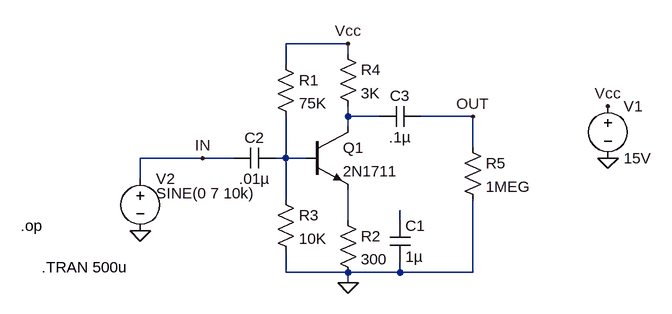
[diagram p0: schematic AMP.asc]
AMP.asc, the LTspice schematic file:
Version 4
SHEET 1 880 680
WIRE 32 32 -64 32
WIRE 32 48 32 32
WIRE -64 64 -64 32
WIRE 32 144 32 128
WIRE 80 144 32 144
WIRE 224 144 144 144
WIRE 32 160 32 144
WIRE 224 192 224 144
WIRE -192 208 -288 208
WIRE -144 208 -192 208
WIRE -64 208 -64 144
WIRE -64 208 -80 208
WIRE -32 208 -64 208
WIRE -288 240 -288 208
WIRE -64 272 -64 208
WIRE 32 304 32 256
WIRE 112 304 112 288
WIRE -64 384 -64 352
WIRE 32 384 -64 384
WIRE 112 384 112 368
WIRE 112 384 32 384
WIRE 224 384 224 272
WIRE 224 384 112 384
WIRE 32 400 32 384
FLAG 32 400 0
FLAG 432 208 0
FLAG 432 128 Vcc
FLAG 32 32 Vcc
FLAG -288 320 0
FLAG 224 144 OUT
FLAG -192 208 IN
SYMBOL npn -32 160 R0
SYMATTR InstName Q1
SYMATTR Value 2N1711
SYMBOL res -80 48 R0
SYMATTR InstName R1
SYMATTR Value 75K
SYMBOL cap 96 304 R0
SYMATTR InstName C1
SYMATTR Value 1µ
SYMBOL res 16 288 R0
SYMATTR InstName R2
SYMATTR Value 300
SYMBOL res -80 256 R0
SYMATTR InstName R3
SYMATTR Value 10K
SYMBOL cap -80 192 R90
WINDOW 0 0 32 VBottom 2
WINDOW 3 32 32 VTop 2
SYMATTR InstName C2
SYMATTR Value .01µ
SYMBOL cap 144 128 R90
WINDOW 0 0 32 VBottom 2
WINDOW 3 32 32 VTop 2
SYMATTR InstName C3
SYMATTR Value .1µ
SYMBOL res 16 32 R0
SYMATTR InstName R4
SYMATTR Value 3K
SYMBOL voltage 432 112 R0
SYMATTR InstName V1
SYMATTR Value 15V
SYMBOL voltage -288 224 R0
WINDOW 3 24 38 Left 2
SYMATTR Value SINE(0 7 10k)
SYMATTR InstName V2
SYMBOL res 208 176 R0
SYMATTR InstName R5
SYMATTR Value 1MEG
TEXT -472 312 Left 2 !.op
TEXT -440 376 Left 2 !.TRAN 500u

The netlist it stands for:
* AMP.asc
Q1 N001 N002 N003 0 2N1711
R1 Vcc N002 75K
C1 N004 0 1µ
R2 N003 0 300
R3 N002 0 10K
C2 N002 IN .01µ
C3 OUT N001 .1µ
R4 Vcc N001 3K
V1 Vcc 0 15V
V2 IN 0 SINE(0 7 10k)
R5 OUT 0 1MEG
.model NPN NPN
.model PNP PNP
.lib standard.bjt
.op
.TRAN 500u
.backanno
.end